# Altium schematic sheet Power Circuit.SchDoc
size A1
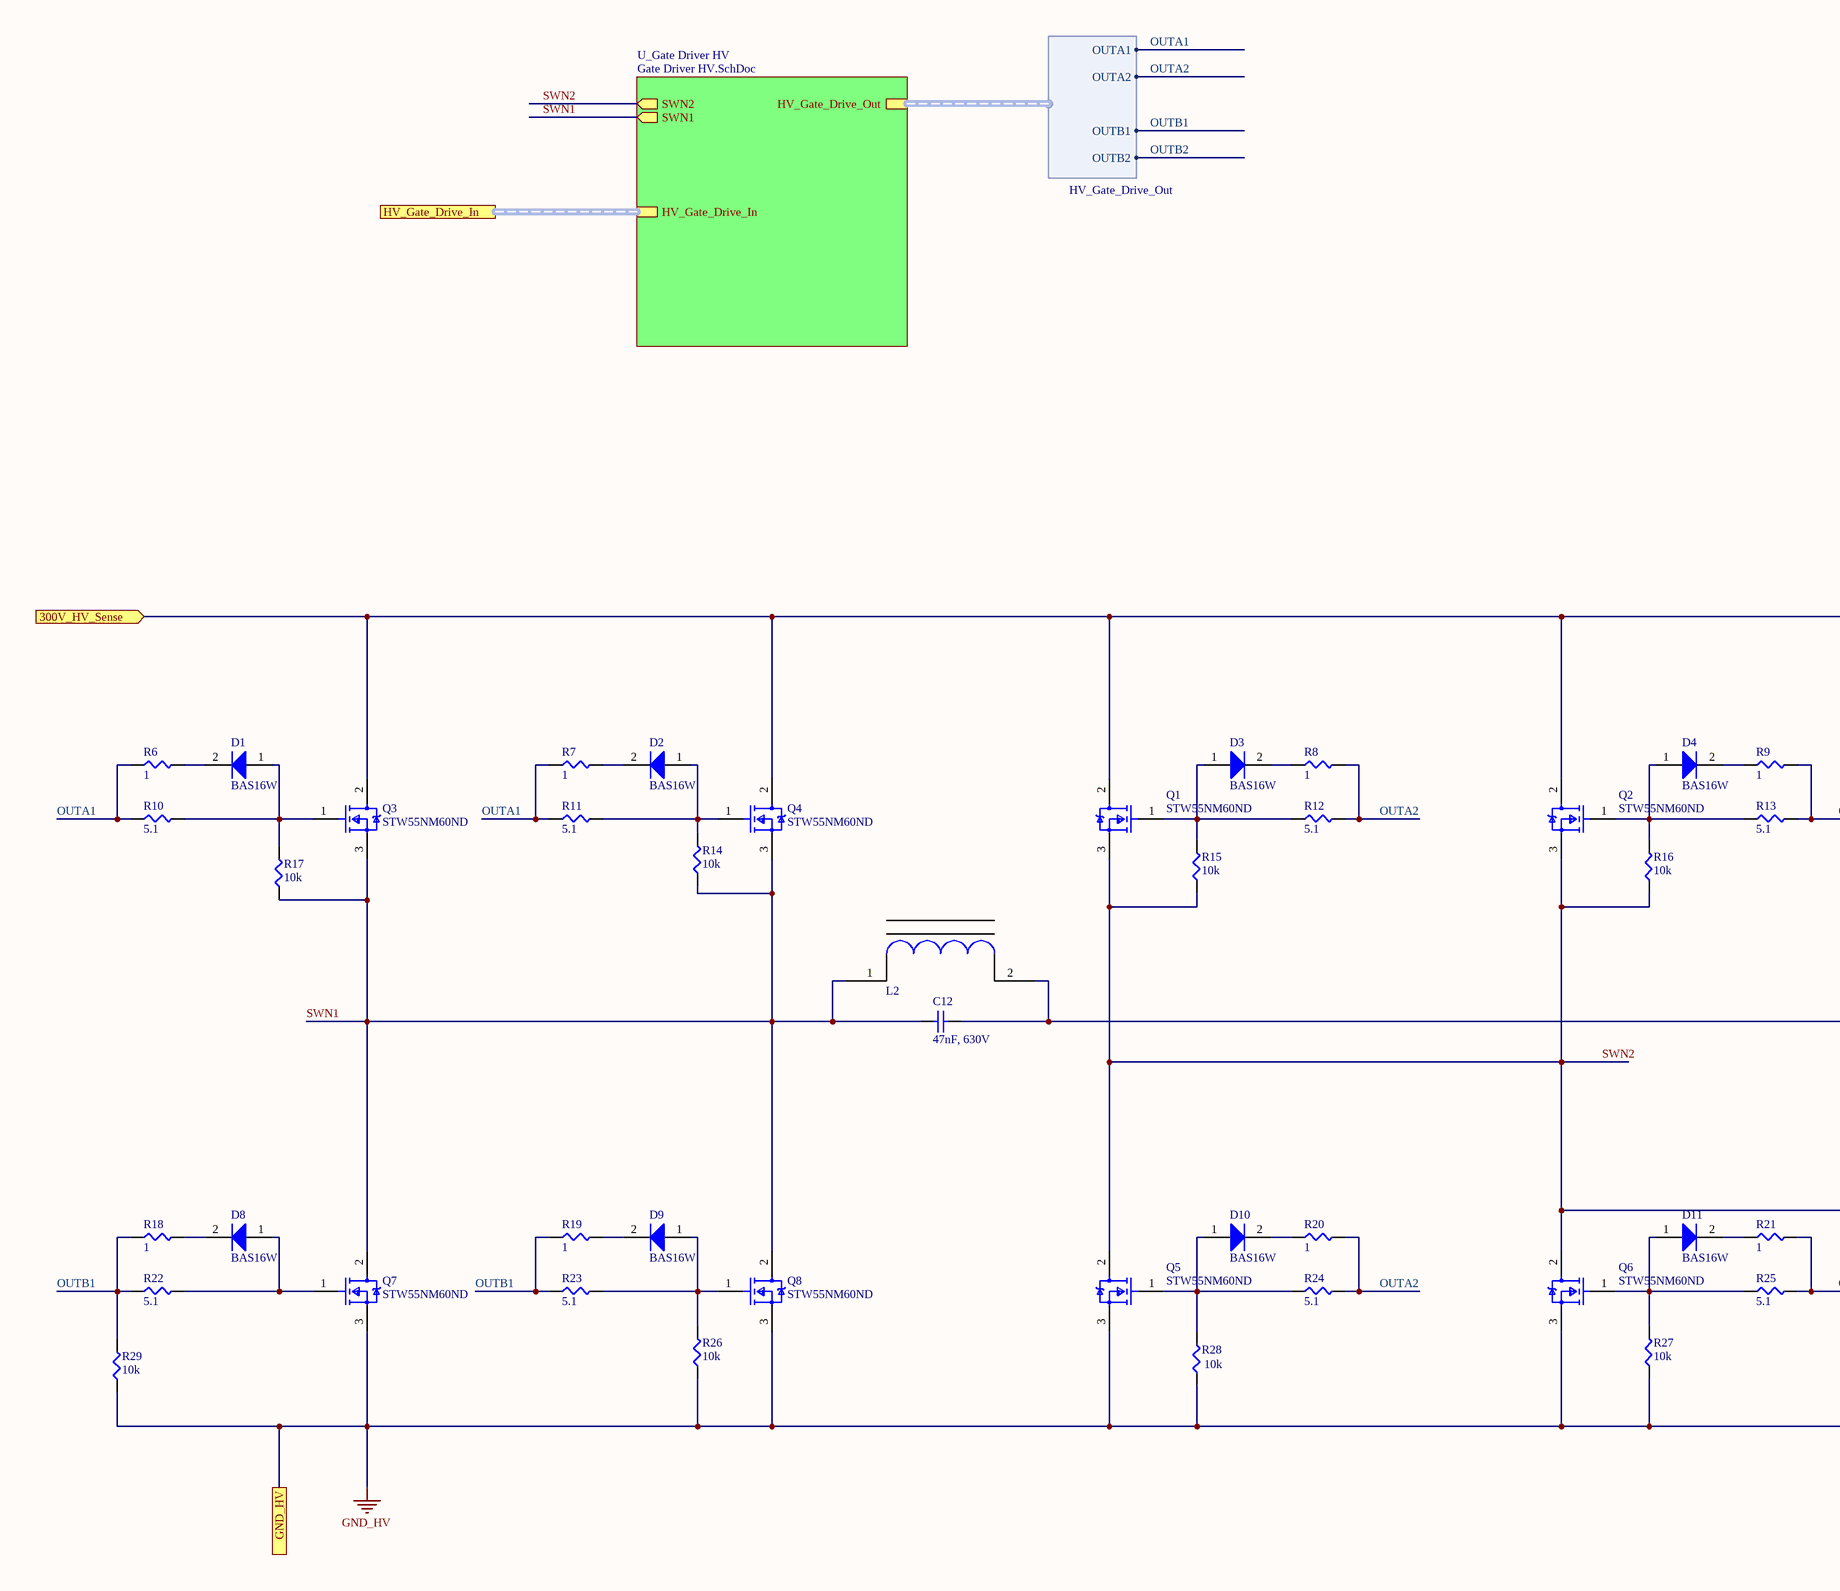
[diagram p0: Power Circuit.SchDoc, left]
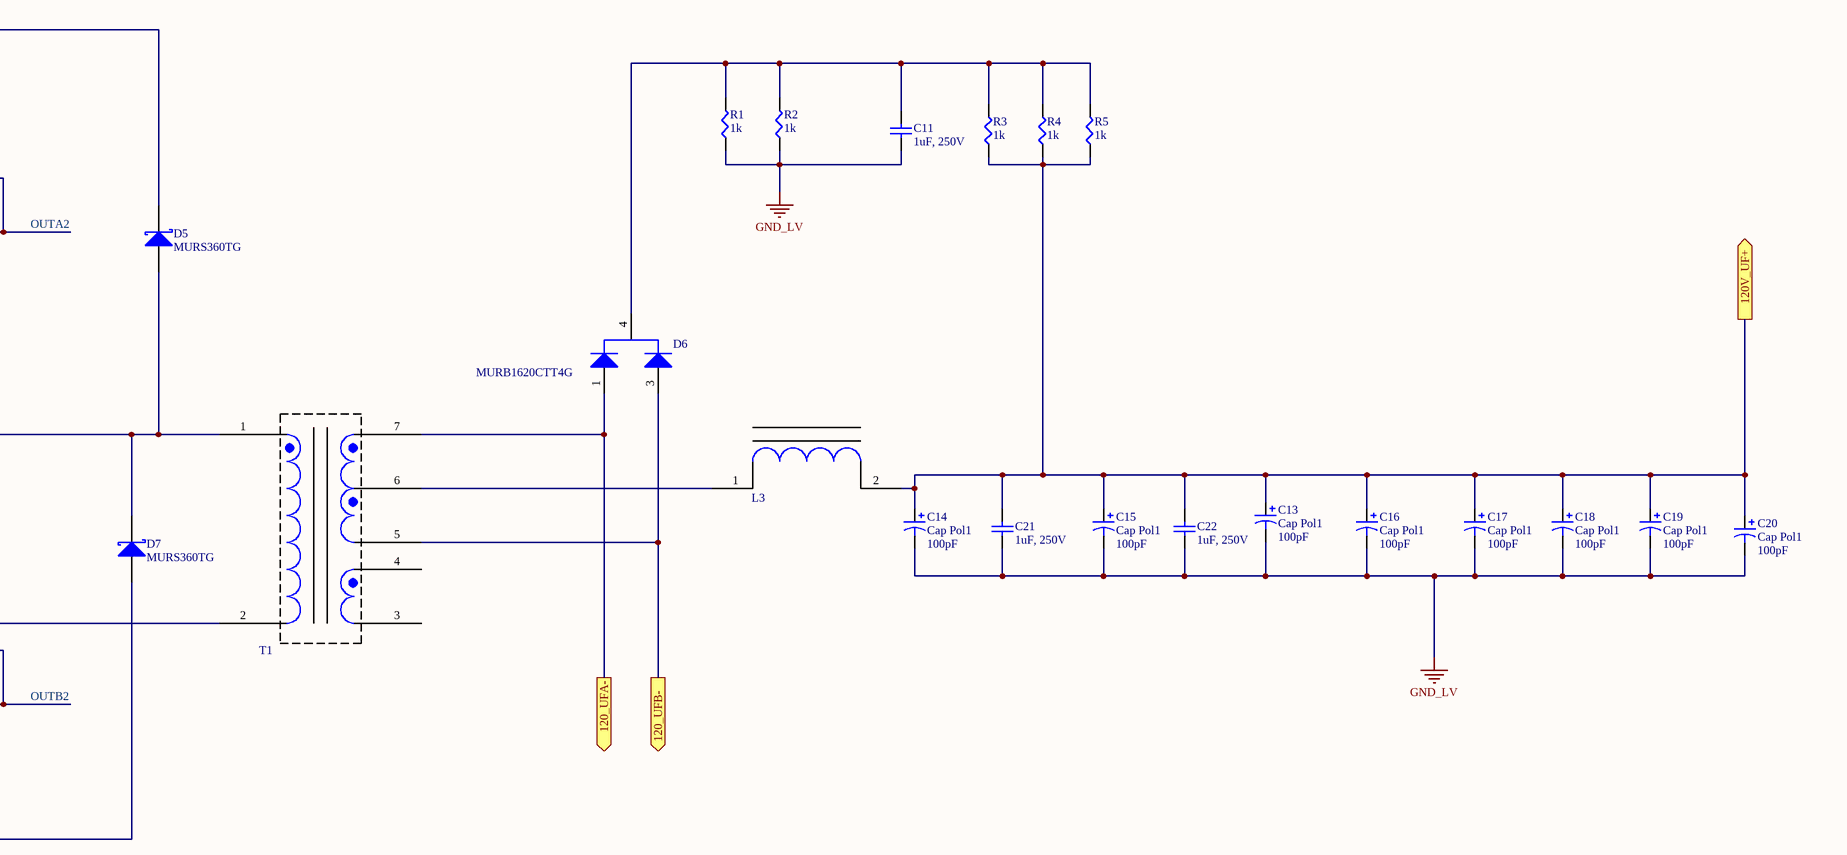
[diagram p1: Power Circuit.SchDoc, right]

## Parts
C11  1uF, 250V  [L18_W7_H13_P15]
C12  47nF, 630V  [L13_W5.5_H11_P10]
C13  Cap Pol1  value 100pF  [450V_25mm_Dia_10mm_pitch]
C14  Cap Pol1  value 100pF  [450V_25mm_Dia_10mm_pitch]
C15  Cap Pol1  value 100pF  [450V_25mm_Dia_10mm_pitch]
C16  Cap Pol1  value 100pF  [450V_25mm_Dia_10mm_pitch]
C17  Cap Pol1  value 100pF  [450V_25mm_Dia_10mm_pitch]
C18  Cap Pol1  value 100pF  [450V_25mm_Dia_10mm_pitch]
C19  Cap Pol1  value 100pF  [450V_25mm_Dia_10mm_pitch]
C20  Cap Pol1  value 100pF  [450V_25mm_Dia_10mm_pitch]
C21  1uF, 250V  [L18_W7_H13_P15]
C22  1uF, 250V  [L18_W7_H13_P15]
D1  BAS16W  [SODFL250X110-2N]
D2  BAS16W  [SODFL250X110-2N]
D3  BAS16W  [SODFL250X110-2N]
D4  BAS16W  [SODFL250X110-2N]
D5  MURS360TG  [VISH-DO-214AB-2_V]
D6  MURB1620CTT4G  [DPAK254P1542X450-3N - diode]
D7  MURS360TG  [VISH-DO-214AB-2_V]
D8  BAS16W  [SODFL250X110-2N]
D9  BAS16W  [SODFL250X110-2N]
D10  BAS16W  [SODFL250X110-2N]
D11  BAS16W  [SODFL250X110-2N]
L2  Transformer_Inductor  [Shim Inductor]  (value not drawn)
L3  Transformer_Inductor  [Toroid_54439_2]  (value not drawn)
Q1  STW55NM60ND  [FP-TO-247-0075325-MFG]
Q2  STW55NM60ND  [FP-TO-247-0075325-MFG]
Q3  STW55NM60ND  [FP-TO-247-0075325-MFG]
Q4  STW55NM60ND  [FP-TO-247-0075325-MFG]
Q5  STW55NM60ND  [FP-TO-247-0075325-MFG]
Q6  STW55NM60ND  [FP-TO-247-0075325-MFG]
Q7  STW55NM60ND  [FP-TO-247-0075325-MFG]
Q8  STW55NM60ND  [FP-TO-247-0075325-MFG]
R1  1k  [SMD-2512-RES]
R2  1k  [SMD-2512-RES]
R3  1k  [SMD-2512-RES]
R4  1k  [SMD-2512-RES]
R5  1k  [SMD-2512-RES]
R6  1  [SMD-0805-RES]
R7  1  [SMD-0805-RES]
R8  1  [SMD-0805-RES]
R9  1  [SMD-0805-RES]
R10  5.1  [SMD-1206-RES]
R11  5.1  [SMD-1206-RES]
R12  5.1  [SMD-1206-RES]
R13  5.1  [SMD-1206-RES]
R14  10k  [SMD-1206-RES]
R15  10k  [SMD-1206-RES]
R16  10k  [SMD-1206-RES]
R17  10k  [SMD-1206-RES]
R18  1  [SMD-0805-RES]
R19  1  [SMD-0805-RES]
R20  1  [SMD-0805-RES]
R21  1  [SMD-0805-RES]
R22  5.1  [SMD-1206-RES]
R23  5.1  [SMD-1206-RES]
R24  5.1  [SMD-1206-RES]
R25  5.1  [SMD-1206-RES]
R26  10k  [SMD-1206-RES]
R27  10k  [SMD-1206-RES]
R28  10k  [SMD-1206-RES]
R29  10k  [SMD-1206-RES]
T1  Transformer_Centre_Tap_Secondaru_Aux_1  [ETD59]  (value not drawn)

## Sub-sheets
U_Gate Driver HV = Gate Driver HV.SchDoc: HV_Gate_Drive_Out (harness HV_Gate_Drive_Out), HV_Gate_Drive_In (harness HV_Gate_Drive_In), SWN2 (out), SWN1 (out)

## Ports
120_UFA- (out), 120_UFB- (out), 120V_UF+ (out), 300V_HV_Sense (in), GND_HV, HV_Gate_Drive_In (harness HV_Gate_Drive_In)

## Harnesses
HV_Gate_Drive_Out: OUTA1, OUTA2, OUTB1, OUTB2

## Nets
GND_HV: D7.1(A) Q5.3(S) Q6.3(S) Q7.3(S) Q8.3(S) R26.1 R27.1 R28.1 R29.1 ; port GND_HV
GND_LV: C11.1 C13.2 C14.2 C15.2 C16.2 C17.2 C18.2 C19.2 C20.2 C21.1 C22.1 R1.1 R2.1
120_UFA-: D6.1(A1) T1.7 ; port 120_UFA-
120_UFB-: D6.3(A2) T1.5 ; port 120_UFB-
120V_UF+: C13.1 C14.1 C15.1 C16.1 C17.1 C18.1 C19.1 C20.1 C21.2 C22.2 L3.2 R3.1 R4.1 R5.1 ; port 120V_UF+
300V_HV_Sense: D5.2(K) Q1.2(D) Q2.2(D) Q3.2(D) Q4.2(D) ; port 300V_HV_Sense
OUTA1: R6.1 R7.1 R10.1 R11.1 ; sheet U_Gate Driver HV/HV_Gate_Drive_Out.OUTA1
OUTA2: R8.2 R9.2 R12.2 R13.2 R20.2 R24.2 ; sheet U_Gate Driver HV/HV_Gate_Drive_Out.OUTA2
OUTB1: R18.1 R19.1 R22.1 R23.1 R29.2 ; sheet U_Gate Driver HV/HV_Gate_Drive_Out.OUTB1
OUTB2: R21.2 R25.2 ; sheet U_Gate Driver HV/HV_Gate_Drive_Out.OUTB2
SWN1: C12.1 L2.1 Q3.3(S) Q4.3(S) Q7.2(D) Q8.2(D) R14.1 R17.1 ; sheet U_Gate Driver HV/SWN1
SWN2: Q1.3(S) Q2.3(S) Q5.2(D) Q6.2(D) R15.1 R16.1 T1.2 ; sheet U_Gate Driver HV/SWN2
NetC11_2: C11.2 D6.4(K) R1.2 R2.2 R3.2 R4.2 R5.2
NetC12_2: C12.2 D5.1(A) D7.2(K) L2.2 T1.1
NetD1_1: D1.1(A) Q3.1(G) R10.2 R17.2
NetD1_2: D1.2(K) R6.2
NetD2_1: D2.1(A) Q4.1(G) R11.2 R14.2
NetD2_2: D2.2(K) R7.2
NetD3_1: D3.1(A) Q1.1(G) R12.1 R15.2
NetD3_2: D3.2(K) R8.1
NetD4_1: D4.1(A) Q2.1(G) R13.1 R16.2
NetD4_2: D4.2(K) R9.1
NetD8_1: D8.1(A) Q7.1(G) R22.2
NetD8_2: D8.2(K) R18.2
NetD9_1: D9.1(A) Q8.1(G) R23.2 R26.2
NetD9_2: D9.2(K) R19.2
NetD10_1: D10.1(A) Q5.1(G) R24.1 R28.2
NetD10_2: D10.2(K) R20.1
NetD11_1: D11.1(A) Q6.1(G) R25.1 R27.2
NetD11_2: D11.2(K) R21.1
NetL3_1: L3.1 T1.6

Not connected (* = marked no-connect by the designer): T1 3 4

## Buses and harness runs
harness port HV_Gate_Drive_In = sheet U_Gate Driver HV/HV_Gate_Drive_In

## Library data of the parts
C11 C21 C22 = 890273425007CS: WCAP-FTBE THT Film Capacitors, 1uF, 250VDC; Insulation Resistance: 3000Ohm x F; Dissipation Factor@100kHz: 4.3%; Dissipation Factor@1kHz: 1%; Dissipation Factor@10kHz: 1.5%; Pitch: 15mm; Rate of Voltage Rise: 11V/us; Technical Reference: MPSP015105K250DCPP45004; ComponentLink1Description: Manufacturer; ComponentLink1URL: http://www.we-online.de; ComponentLink2Description: Datasheet; ComponentLink2URL: https://katalog.we-online.com/pbs/datasheet/890273425007CS.pdf; Length: 18mm; Mounting Technology: THT; Packaging: Carton; Part Number: 890273425007CS; Operating Temperature: -40 to +85degC; Width: 7mm; Capacitance: 1uF; Height: 13mm; Rated Voltage: 250VDC; Publisher: Wurth Elektronik; Published Date: August 2019
C12 = 890303323004CS: WCAP-FTBP THT Film Capacitors, 47nF, 630VDC; Insulation Resistance: 30000MOhm; Dissipation Factor@100kHz: 0.29%; Dissipation Factor@1kHz: 0.1%; Dissipation Factor@10kHz: 10%; Pitch: 10mm; Rate of Voltage Rise: 430V/us; Technical Reference: MPPP010473J630DCPP55004; ComponentLink1Description: Manufacturer; ComponentLink1URL: http://www.we-online.de; ComponentLink2Description: Datasheet; ComponentLink2URL: https://katalog.we-online.com/pbs/datasheet/890303323004CS.pdf; Length: 13mm; Mounting Technology: THT; Packaging: Carton; Part Number: 890303323004CS; Operating Temperature: -40 to +105degC; Width: 5.5mm; Capacitance: 47nF; Height: 11mm; Rated Voltage: 630VDC; Publisher: Wurth Elektronik; Published Date: August 2019
C13-C20 = Cap Pol1: Polarized Capacitor (Radial); Published: 8-Jun-2000; LatestRevisionDate: 17-Jul-2002; LatestRevisionNote: Re-released for DXP Platform.; PackageReference: RB7.6-15; Publisher: Altium Limited; PackageDescription: Polarized Capacitor (Radial); 2 Leads
D1-D4 D8-D11 = BAS16_SOD: Silicon Switching Diode, SOT323, Reel, Green; Manufacturer: Infineon; IR (max): 100Â nA; Configuration: Single; VBR (min): 85Â V; VR (max): 80Â V; trr (max): 4Â ns; Green: TRUE; VF (max): 1.25Â V; IF (max): 250Â mA; Mounting Technology: Surface Mount; PackageReference: SOT323; ComponentLink2URL: http://www.infineon.com/dgdl/bas16series.pdf?folderId=db3a30431400ef6801141b5844e103ea&fileId=db3a30431400ef6801141b93811b03ff; Halogen-free: TRUE; ComponentLink2Description: Datasheet; PartNumber: BAS16W; ComponentLink1Description: Manufacturer URL; ComponentLink3URL: http://www.infineon.com/dgdl/SOT323-Package_Overview.pdf?folderId=db3a30431936bc4b0119533e1dcb3c92&fileId=db3a30431936bc4b011953495f283cb1; ComponentLink1URL: http://www.infineon.com/; PackageDescription: 3-Pin Small Outline Transistor Package, 1.25 x 2 mm Body, 0.65 mm Pitch; ComponentLink3Description: Package Specification
D5 D7 = CMP-2000-07150-1: Surface Mount Schottky Barrier Rectifier, 600 V, 3 A, -55 to 150 degC, 2-Pin SMC (DO-214AB), RoHS, Tape and Reel; Manufacturer: Vishay; Forward Current If(AV): 3A; Diode Configuration: Single; Forward Surge Current Ifsm Max: 100A; SVHC: ToBeAdvised; No. of Pins: 2Pins; Forward Voltage VF Max: 750mV; Repetitive Reverse Voltage Vrrm Max: 60V; Datasheet URL: http://www.vishay.com/docs/88751/ss32.pdf; Datasheet Version: 08/2015; Manufacturer URL: http://www.vishay.com/; Diode Type: Schottky; Package Reference: DO-214AB; Mounting Technology: SurfaceMount; Diode Case Style: DO-214AB; Package Description: 2-Pin Surface Mount Device, Body 6.855 x 5.905 mm; Packaging: CutTape; Operating Temperature Max: 150°C; Product Range: -
D6 = CMP-0902-00228-1: SWITCHMODE(TM) Power Rectifier, 3-Pin D2PAK, Pb-Free, Tape and Reel; Manufacturer: On Semiconductor; IFSM Max (A): 100; VRRM Max (V): 200; Type: Ultrafast; ComponentLink2URL: http://www.onsemi.cn/pub_link/Collateral/MURB1620CT-D.PDF; Mounting Technology: Surface Mount; PackageReference: D2PAK-3-418B-04; PackageDescription: 3-Pin Flange Mount, Body 9.145 x 9.97 mm, Pitch 2.54 mm; PackageVersion: Rev. K, 09/2008; RoHS: TRUE; PartNumber: MURB1620CTT4G; Packing: Tape and Reel; ComponentLink1URL: http://www.onsemi.com/; ComponentLink3Description: Package Specification; ComponentLink3URL: http://www.onsemi.com/pub_link/Collateral/418B-04.PDF; DatasheetVersion: Rev. 7; ComponentLink2Description: Datasheet; ComponentLink1Description: Manufacturer URL
Q1-Q8 = CMP-12198-000021-1: MOSFET N-CH 600V 51A TO-247; Obsolete Part: true; Manufacturer: STMicroelectronics; Max Forward Diode Voltage: 1.3V; Drain To Source Resistance: 0.047Ω; Turn Off Delay Time: 188ns; Threshold Vgs Min: 3V; Rthja Max: 50°C/W; Threshold Vgs Max: 5V; Transconductance: 45S; Depletion Mode: False; Turn On Delay Time: 33ns; Gate Charge At Vgs: 190nC @ 10V; Standoff Height: 3.7mm; Number Of Channels: 1; Gate To Source Voltage: 25V; Max Junction Temp: +150°C; Reverse Recovery Time: 200ns; Reverse Recovery Charge: 1800nC; Pulse Drain Current: 204A; Input Capacitace At Vds: 5800pF @ 50V; Power Dissipation: 350W; Automotive: No; RoHS: TRUE; Continuous Drain Current: 51A; ComponentLink2Description: Datasheet; Digikey Description: MOSFET N-CH 600V 51A TO-247; Device Class L1: Discrete Semiconductors; Package: TO-247-0075325; Height: 24.45mm; Manufacturer Part Number: STW55NM60ND; Drain To Source Voltage: 600V; ComponentLink2URL: https://www.mouser.in/datasheet/2/389/en.CD00176812-1218252.pdf; Temperature Range High: +150°C; Octopart: https://octopart.com/stw55nm60nd-stmicroelectronics-8600607; Category: Trans; Device Class L3: MOSFETs; Ipc Land Pattern Name: TO-220; Device Class L2: Transistors; Drain To Source Breakdown Voltage: 600V; Lead Free: Yes; Temperature: to +150°C; Mouser Description: MOSFET N-channel 600 V FDMesh; Number Of N Channels: 1
R1-R5 = ERJ-1TNF1001U: RES SMD 1K OHM 1% 1W 2512; Manufacturer: Panasonic Electronic Components; Factory Stock: 0; Unit Price (USD): 0.14799; @ qty: 1500; Minimum Quantity: 1; Temperature Coefficient: ±100ppm/°C; Part Number: ERJ-1TNF1001U; Datasheets: http://industrial.panasonic.com/www-cgi/jvcr13pz.cgi?E+PZ+3+AOA0002+ERJ1TNF1001U+7+WW; Image: //media.digikey.com/Renders/Panasonic%20Renders/ERJ-2512%20Pkg.jpg; Digi-Key Part Number: PT1.00KAFCT-ND; Quantity Available: 16384; Packaging: Cut Tape (CT); Series: ERJ; Part Status: Active; Value: 1k; Tolerance: ±1%; Power (Watts): 1W; Composition: Thick Film; Features: Automotive AEC-Q200; Operating Temperature: -55°C ~ 155°C; Package / Case: 2512 (6432 Metric); Supplier Device Package: 2512; Size / Dimension: 0.252" L x 0.126" W (6.40mm x 3.20mm); Height - Seated (Max): 0.028" (0.70mm); Number of Terminations: 2; Failure Rate: -
R6-R9 R18-R21 = ERJ-6BQF1R0V: RES SMD 1 OHM 1% 1/3W 0805; Manufacturer: Panasonic Electronic Components; Factory Stock: 0; Unit Price (USD): 0.05834; @ qty: 1500; Power (Watts): 0.333W, 1/3W; Temperature Coefficient: ±200ppm/°C; Part Number: ERJ-6BQF1R0V; Datasheets: https://industrial.panasonic.com/cdbs/www-data/pdf/RDA0000/AOA0000C239.pdf; Image: //media.digikey.com/Renders/Panasonic%20Renders/ERJ-0805%20Pkg.jpg; Digi-Key Part Number: P17499CT-ND; Quantity Available: 808; Minimum Quantity: 1; Packaging: Cut Tape (CT); Series: ERJ; Part Status: Active; Value: 1; Tolerance: ±1%; Composition: Thick Film; Features: Automotive AEC-Q200, Current Sense; Operating Temperature: -55°C ~ 125°C; Package / Case: 0805 (2012 Metric); Supplier Device Package: 0805; Size / Dimension: 0.079" L x 0.049" W (2.00mm x 1.25mm); Height - Seated (Max): 0.028" (0.70mm); Number of Terminations: 2; Failure Rate: -
R10-R13 R22-R25 = ERJ-8BQF5R1V: RES SMD 5.1 OHM 1% 1/2W 1206; Manufacturer: Panasonic Electronic Components; Factory Stock: 0; Unit Price (USD): 0.05778; @ qty: 1500; Minimum Quantity: 1; Power (Watts): 0.5W, 1/2W; Temperature Coefficient: ±200ppm/°C; Part Number: ERJ-8BQF5R1V; Datasheets: https://industrial.panasonic.com/cdbs/www-data/pdf/RDA0000/AOA0000C239.pdf; Image: //media.digikey.com/Renders/Panasonic%20Renders/ERJ-1206%20Pkg.jpg; Digi-Key Part Number: P17617CT-ND; Quantity Available: 4802; Packaging: Cut Tape (CT); Series: ERJ; Part Status: Active; Value: 5.1; Tolerance: ±1%; Composition: Thick Film; Features: Automotive AEC-Q200, Current Sense; Operating Temperature: -55°C ~ 125°C; Package / Case: 1206 (3216 Metric); Supplier Device Package: 1206; Size / Dimension: 0.126" L x 0.063" W (3.20mm x 1.60mm); Height - Seated (Max): 0.028" (0.70mm); Number of Terminations: 2; Failure Rate: -
R14-R17 R26-R29 = ERJ-8ENF1002V: RES SMD 10K OHM 1% 1/4W 1206; Manufacturer: Panasonic Electronic Components; Factory Stock: 0; Unit Price (USD): 0.00933; @ qty: 1500; Minimum Quantity: 1; Power (Watts): 0.25W, 1/4W; Temperature Coefficient: ±100ppm/°C; Part Number: ERJ-8ENF1002V; Datasheets: http://industrial.panasonic.com/www-cgi/jvcr13pz.cgi?E+PZ+3+AOA0002+ERJ8ENF1002V+7+WW; Image: //media.digikey.com/Renders/Panasonic%20Renders/ERJ-1206%20Pkg.jpg; Digi-Key Part Number: P10.0KFCT-ND; Quantity Available: 1108398; Packaging: Cut Tape (CT); Series: ERJ; Part Status: Active; Value: 10k; Tolerance: ±1%; Composition: Thick Film; Features: Automotive AEC-Q200; Operating Temperature: -55°C ~ 155°C; Package / Case: 1206 (3216 Metric); Supplier Device Package: 1206; Size / Dimension: 0.126" L x 0.063" W (3.20mm x 1.60mm); Height - Seated (Max): 0.028" (0.70mm); Number of Terminations: 2; Failure Rate: -